# EAGLE design preamp2 (EAGLE 5.11)
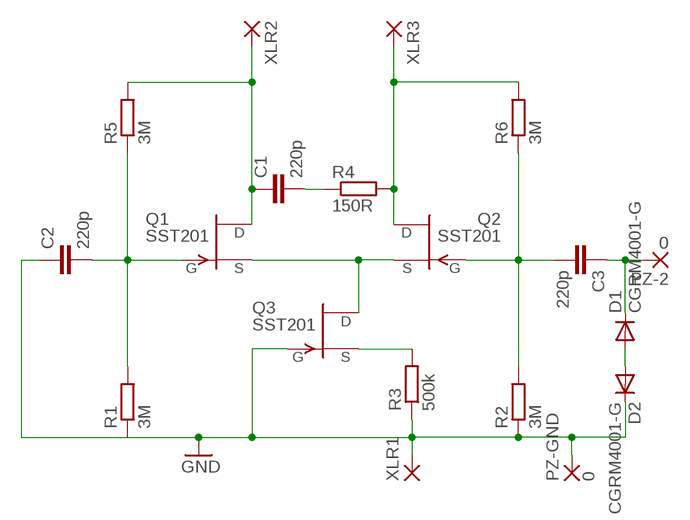
[diagram p0: schematic, sheet 1]

## Parts
C1  220p  C-EUC1206  [C1206]
C2  220p  C-EUC1206  [C1206]
C3  220p  C-EUC1206  [C1206]
D1  CGRM4001-G  [SOD-123_MINI-SMA]
D2  CGRM4001-G  [SOD-123_MINI-SMA]
PZ-2  0  3,17/1,3  [3,17/1,3]
PZ-GND  0  3,17/1,3  [3,17/1,3]
Q1  SST201  [SOT23]
Q2  SST201  [SOT23]
Q3  SST201  [SOT23]
R1  3M  R-EU_R1206  [R1206]
R2  3M  R-EU_R1206  [R1206]
R3  500k  R-EU_R1206  [R1206]
R4  150R  R-EU_R1206  [R1206]
R5  3M  R-EU_R1206  [R1206]
R6  3M  R-EU_R1206  [R1206]
XLR1  3,17/1,3  [3,17/1,3]
XLR2  3,17/1,3  [3,17/1,3]
XLR3  3,17/1,3  [3,17/1,3]

## Nets
GND: C2.1 D2.C PZ-GND.1(P) Q3.3(G) R1.1 R2.1 R3.1 XLR1.1(P)
N$1: Q1.2(S) Q2.2(S) Q3.1(D)
N$2: D1.A D2.A
N$3: C2.2 Q1.3(G) R1.2 R5.1
N$5: C1.2 R4.1
N$6: C3.1 D1.C PZ-2.1(P)
N$7: C3.2 Q2.3(G) R2.2 R6.1
N$9: Q3.2(S) R3.2
XLR3: Q2.1(D) R4.2 R6.2 XLR3.1(P)
XLR-2: C1.1 Q1.1(D) R5.2 XLR2.1(P)

## Library data of the parts
C1-C3 = rcl:C-EU: CAPACITOR, European symbol
D1 D2 = diode:CGRM400*-G: Molded plasitc,JEDEC SOD-123/Mini SMA Source: Comchip CGRM4001-G.pdf
PZ-2 PZ-GND XLR1-XLR3 = wirepad:3,17/1,3: THROUGH-HOLE PAD
Q1-Q3 = transistor-fet:?20*: TEMIC / Siliconix N-Channel JFET Source: JFET-J201_Siliconix_data.pdf
R1-R6 = rcl:R-EU_: RESISTOR, European symbol

## Board
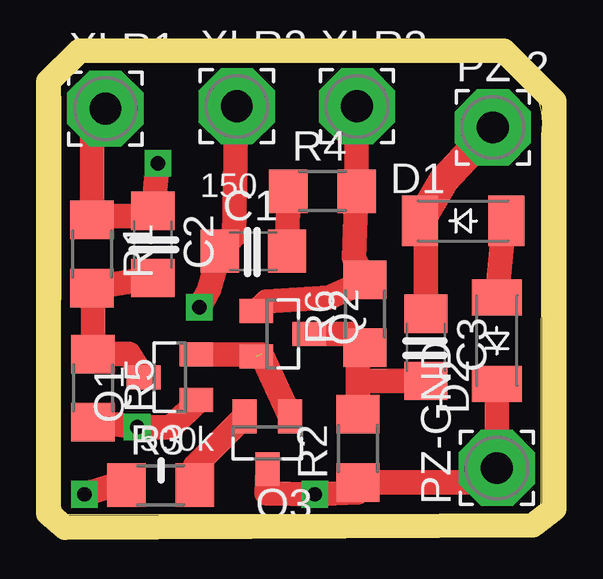
[diagram p1: board, top side]
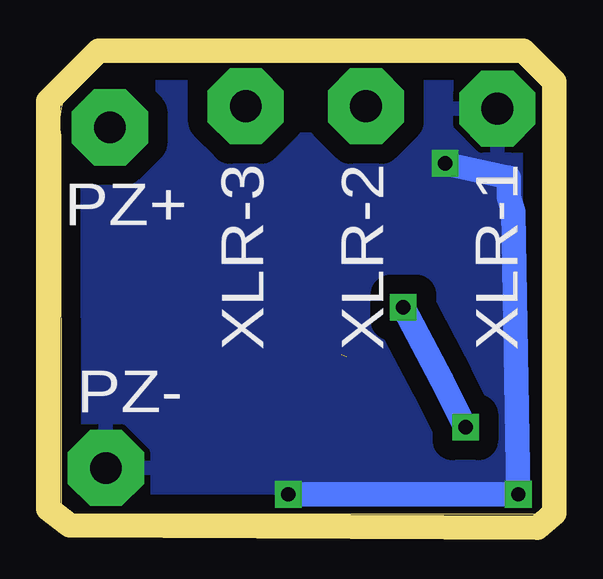
[diagram p2: board, bottom side, seen from below]

Size 20.13 x 18.96 mm. Coordinates in mm from the lower left corner, seen from the top.
Outline: 20.08,15.83 arc90 17.95,18.96 1.08,18.96 arc90 0.02,17.4 0,0.44 arc91 0.45,0 19.49,0 arc93 20.07,0.61 20.08,15.83
Copper layers (1*16): Top 0.035mm / dielectric 1.5mm / Bottom 0.035mm
Design rules "SparkFun": minimum track width 8mil, minimum drill 20mil, track to track 8mil, track to pad 8mil, pad to pad 8mil, via to via 8mil, smd to smd 8mil, copper to edge 10mil, drill to drill 8mil, minimum pad ring 12mil, minimum via ring 10mil, stop-mask expansion 4mil, vias tented up to drill 25mil, thermal gap 10mil
Milling: 8 lines

### Footprints (pad centres in the part's own frame; a part is rotated, then mirrored left to right if it is on the bottom)
C1206 = smd 1.6 x 1.8: 1 -1.4,0; 2 1.4,0
SOD-123_MINI-SMA = smd 1.5 x 2.1: A 1.8,0; C -1.8,0
3,17/1,3 = drill 1.321 pad 3.175 octagon: 1 0,0
SOT23 = smd 1 x 1.4: 1 -0.95,-1.1; 2 0.95,-1.1; 3 0,1.1
R1206 = smd 1.6 x 1.803: 1 -1.422,0; 2 1.422,0

### Placement (x,y rotation side)
C1  8.07,10.98 0 top
C2  3.88,11.26 270 top
C3  15.26,6.97 270 top
D1  16.82,12.24 0 top
D2  18.22,7.24 90 top
PZ-2  18.05,16.14 0 top
PZ-GND  18.22,1.94 90 top
Q1  4.59,5.72 90 top
Q2  9.29,7.53 270 top
Q3  8.65,2.99 180 top
R1  1.34,10.86 270 top
R2  12.42,2.76 90 top
R3  4.2,1.22 0 top
R4  10.95,13.48 0 top
R5  1.38,5.27 270 top
R6  12.72,8.37 90 top
XLR1  1.89,16.93 0 top
XLR2  7.37,17.03 0 top
XLR3  12.39,17.03 0 top

### Tracks (layer width: path | path; a pad name or v marks a point on that pad's centre or on a via)
GND  (via drill 0.6)
  Top 0.406: 1.34,12.26 R1.1
  Top 0.61: R1.1 1.08,12.54
  Top 1.016: v4.08,14.64 C2.1 3.88,12.44 1.22,12.44 1.22,12.26 1.34,12.26 | R3.1 2.22,1.22 v1.02,0.84 | XLR1.1 1.34,16.13 R1.1 | Q3.3 8.62,0.89 v10.62,0.84 12.42,0.94 R2.1 17.22,1.34 PZ-GND.1 D2.C
  Bottom 1.016: v10.62,0.84 v1.02,0.84 1.22,12.64 1.42,13.24 1.42,14.04 v4.08,14.64
  pour Bottom (isolate 0.813): 17.48,18.44 arc-90 19.22,16.3 19.42,1.61 arc-90 18.45,0.64 1.5,0.64 arc-90 0.62,1.93 0.62,17.52 arc-90 1.74,18.44
N$1  (1 unrouted)
  Top 1.016: Q1.2 8.4,6.67 Q3.1
N$2
  Top 1.016: D1.A 18.42,11.24 D2.A
N$3
  Top 0.5: 1.34,9.46 R1.2 1.38,9.44
  Top 1.016: 1.34,9.46 C2.2 | 1.38,9.44 R5.1 2.89,6.7 Q1.3
N$5
  Top 1.016: R4.1 9.47,11.28 C1.2
N$6
  Top 1.016: D1.C 15.26,12.04 C3.1
  Top 1.27: PZ-2.1 16.02,13.94 D1.C
N$7
  Top 0.406: 12.42,6.75 R6.1
  Top 0.5: 12.12,7.27 R6.1 12.12,7.53
  Top 1.016: 12.12,7.53 Q2.3 | 12.42,5.57 12.42,6.75 | 12.42,5.57 C3.2 | R2.2 12.42,5.57
N$9
  Top 0.406: R3.2 5.63,2.02
  Top 1.016: 5.63,2.02 Q3.2
XLR3
  Top 1.016: XLR3.1 12.37,16.03 R4.2 12.27,10.7 R6.2 12.12,9.44 11.22,9.04 8.62,8.88 Q2.1
XLR-2  (via drill 0.6)
  Top 1.016: v5.82,8.64 6.22,9.38 C1.1 7.27,11.63 XLR2.1 | R5.2 1.78,3.84 v3.22,3.64 4.62,3.64 5.82,4.77 Q1.1
  Bottom 1.016: v5.82,8.64 4.22,5.64 v3.22,3.64

### Text on the board
tPlace: 150 | 500k
bPlace: XLR-1 | XLR-2 | XLR-3 | PZ+ | PZ-